# EAGLE design Lollo_Roco_43840_LED_no_R_J2_021_04_01 (EAGLE 5.10)
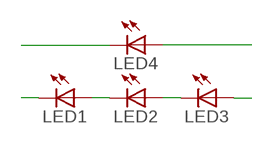
[diagram p0: schematic, sheet 1]

## Parts
LED1  LEDCHIPLED_0603  [CHIPLED_0603]
LED2  LEDCHIPLED_0603-JP  [CHIPLED-0603-JP]
LED3  LEDCHIPLED_0603  [CHIPLED_0603]
LED4  LEDCHIPLED_0603  [CHIPLED_0603]

## Nets
LED+: LED3.A
LED+1: LED4.A
LED-: LED1.C
LED-1: LED4.C
N$6: LED1.A LED2.C
N$7: LED2.A LED3.C

## Library data of the parts
LED1-LED4 = led:LED: LED OSRAM: - CHIPLED LG R971, LG N971, LY N971, LG Q971, LY Q971, LO R971, LY R971 LH N974, LH R974 LS Q976, LO Q976, LY Q976 LO Q996 - Hyper CHIPLED LW Q18S LB Q993, LB Q99A, LB R99A - SideLED LS A670, LO A670, LY A670, LG A670, LP A670 LB A673, LV A673, LT A673, LW A673 LH A674 LY A675 LS A676, LA A676, LO A676, LY A676, LW A676 LS A679, LY A679, LG A679 - Hyper Micro SIDELED® LS Y876, LA Y876, LO Y876, LY Y876 LT Y87S - SmartLED LW L88C, LW L88S LB L89C, LB L89S, LG L890 LS L89K, LO L89K, LY L89K LS L896, LA L896, LO L896, LY L896 - TOPLED LS T670, LO T670, LY T670, LG T670, LP T670 LSG T670, LSP T670, LSY T670, LOP T670, LYG T670 LG T671, LOG T671, LSG T671 LB T673, LV T673, LT T673, LW T673 LH T674 LS T676, LA T676, LO T676, LY T676, LB T676, LH T676, LSB T676, LW T676 LB T67C, LV T67C, LT T67C, LS T67K, LO T67K, LY T67K, LW E67C LS E67B, LA E67B, LO E67B, LY E67B, LB E67C, LV E67C, LT E67C LW T67C LS T679, LY T679, LG T679 LS T770, LO T770, LY T770, LG T770, LP T770 LB T773, LV T773, LT T773, LW T773 LH T774 LS E675, LA E675, LY E675, LS T675 LS T776, LA T776, LO T776, LY T776, LB T776 LHGB T686 LT T68C, LB T68C - Hyper Mini TOPLED® LB M676 - Mini TOPLED Santana® LG M470 LS M47K, LO M47K, LY M47K Source: http://www.osram.convergy.de LUXEON: - LUMILED® LXK2-PW12-R00, LXK2-PW12-S00, LXK2-PW14-U00, LXK2-PW14-V00 LXK2-PM12-R00, LXK2-PM12-S00, LXK2-PM14-U00 LXK2-PE12-Q00, LXK2-PE12-R00, LXK2-PE12-S00, LXK2-PE14-T00, LXK2-PE14-U00 LXK2-PB12-K00, LXK2-PB12-L00, LXK2-PB12-M00, LXK2-PB14-N00, LXK2-PB14-P00, LXK2-PB14-Q00 LXK2-PR12-L00, LXK2-PR12-M00, LXK2-PR14-Q00, LXK2-PR14-R00 LXK2-PD12-Q00, LXK2-PD12-R00, LXK2-PD12-S00 LXK2-PH12-R00, LXK2-PH12-S00 LXK2-PL12-P00, LXK2-PL12-Q00, LXK2-PL12-R00 Source: www.luxeon.com KINGBRIGHT: KA-3528ASYC Source: www.kingbright.com

## Board
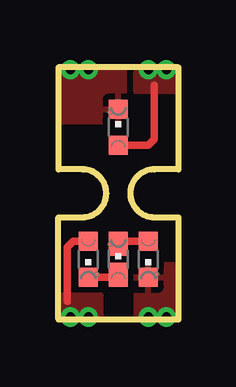
[diagram p1: board, top side]
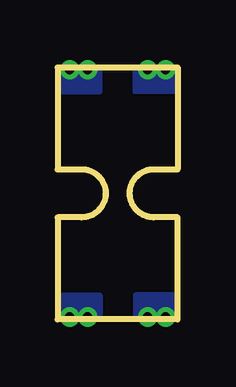
[diagram p2: board, bottom side, seen from below]

No outline drawn. Coordinates in mm, seen from the top.
Copper layers (1*16): Top 0.035mm / dielectric 1.5mm / Bottom 0.035mm
Design rules "default *": minimum track width 10mil, minimum drill 0.4mm, track to track 8mil, track to pad 8mil, pad to pad 8mil, via to via 8mil, smd to smd 8mil, copper to edge 40mil, drill to drill 8mil, minimum pad ring 10mil, minimum via ring 8mil, stop-mask expansion 4mil, vias tented up to drill 0mil, thermal gap 10mil
Milling: 14 lines

### Footprints (pad centres in the part's own frame; a part is rotated, then mirrored left to right if it is on the bottom)
CHIPLED_0603 = smd 0.8 x 0.8: A 0,-0.75; C 0,0.75
CHIPLED-0603-JP = smd 0.8 x 1: A 0,-0.65; C 0,0.65

### Placement (x,y rotation side)
LED1  3.75,2.5 180 top
LED2  2.5,2.5 0 top
LED3  1.25,2.5 180 top
LED4  2.5,8 0 top

### Tracks (layer width: path | path; a pad name or v marks a point on that pad's centre or on a via)
LED+  (via drill 0.4)
  Top 0.305: LED3.A 0.62,3.25 0.38,3 0.38,0.75
  other vias: 0.5,0.1 1.25,0.1
  pour Top: 0.2,0.2 0.2,1 1.75,1 1.75,0.2
  pour Bottom: 0.2,0.2 0.2,1 1.75,1 1.75,0.2
LED+1  (via drill 0.4)
  Top 0.305: LED4.A 3.75,7.25 4,7.5 4,9.75
  other vias: 4.5,10.4 3.75,10.4
  pour Bottom: 4.8,10.3 4.8,9.5 3.25,9.5 3.25,10.3
  pour Top: 4.8,10.3 4.8,9.5 3.25,9.5 3.25,10.3
LED-  (via drill 0.4)
  other vias: 4.5,0.1 3.75,0.1
  pour Top: 3.25,2.25 3.25,0.2 4.8,0.2 4.8,2.25
  pour Bottom: 3.25,1 3.25,0.2 4.8,0.2 4.8,1
LED-1  (via drill 0.4)
  other vias: 0.5,10.4 1.25,10.4
  pour Bottom: 1.75,9.5 1.75,10.3 0.2,10.3 0.2,9.5
  pour Top: 2.75,8.25 2.75,10.3 0.2,10.3 0.2,8.25
N$6
  Top 0.305: LED2.C 2.6,3.25 LED1.A
N$7
  Top 0.305: LED2.A 2.4,1.75 LED3.C

### Text on the board
tStop: + | +